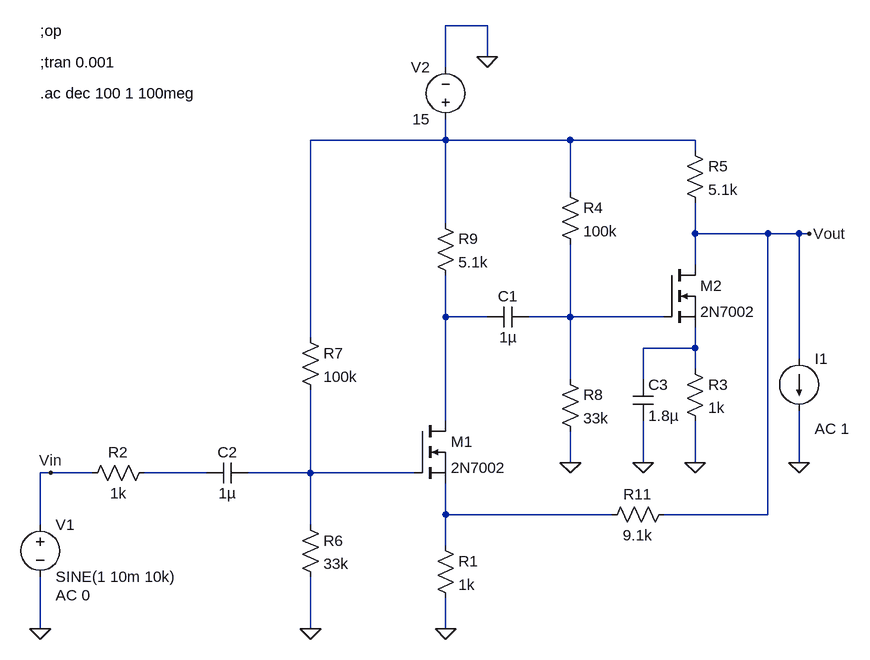
[diagram p0: schematic Nhóm05-L02-BTL MDTNC (Series-Shunt_feedback - Copy).asc]
Nhóm05-L02-BTL MDTNC (Series-Shunt_feedback - Copy).asc, the LTspice schematic file:
Version 4
SHEET 1 952 680
WIRE 336 -480 272 -480
WIRE 336 -432 336 -480
WIRE 272 -416 272 -480
WIRE 272 -304 272 -336
WIRE 272 -304 64 -304
WIRE 464 -304 272 -304
WIRE 656 -304 464 -304
WIRE 656 -288 656 -304
WIRE 464 -224 464 -304
WIRE 272 -176 272 -304
WIRE 656 -160 656 -208
WIRE 768 -160 656 -160
WIRE 816 -160 768 -160
WIRE 832 -160 816 -160
WIRE 656 -112 656 -160
WIRE 272 -32 272 -96
WIRE 336 -32 272 -32
WIRE 464 -32 464 -144
WIRE 464 -32 400 -32
WIRE 608 -32 464 -32
WIRE 64 0 64 -304
WIRE 656 16 656 -16
WIRE 656 16 576 16
WIRE 816 32 816 -160
WIRE 656 48 656 16
WIRE 464 64 464 -32
WIRE 576 64 576 16
WIRE 272 128 272 -32
WIRE 464 192 464 144
WIRE 576 192 576 128
WIRE 656 192 656 128
WIRE 816 192 816 112
WIRE -336 208 -352 208
WIRE -272 208 -336 208
WIRE -96 208 -192 208
WIRE 64 208 64 80
WIRE 64 208 -32 208
WIRE 224 208 64 208
WIRE 272 272 272 224
WIRE 528 272 272 272
WIRE 768 272 768 -160
WIRE 768 272 608 272
WIRE -352 288 -352 208
WIRE 64 288 64 208
WIRE 272 320 272 272
WIRE -352 448 -352 368
WIRE 64 448 64 368
WIRE 272 448 272 400
FLAG -352 448 0
FLAG -336 208 Vin
FLAG 272 448 0
FLAG 336 -432 0
FLAG 832 -160 Vout
FLAG 64 448 0
FLAG 464 192 0
FLAG 576 192 0
FLAG 656 192 0
FLAG 816 192 0
SYMBOL nmos 224 128 R0
SYMATTR InstName M1
SYMATTR Value 2N7002
SYMBOL nmos 608 -112 R0
SYMATTR InstName M2
SYMATTR Value 2N7002
SYMBOL res -176 192 R90
WINDOW 0 0 56 VBottom 2
WINDOW 3 32 56 VTop 2
SYMATTR InstName R2
SYMATTR Value 1k
SYMBOL voltage -352 272 R0
WINDOW 123 24 124 Left 2
WINDOW 39 0 0 Left 0
SYMATTR Value2 AC 0
SYMATTR InstName V1
SYMATTR Value SINE(1 10m 10k)
SYMBOL res 256 304 R0
SYMATTR InstName R1
SYMATTR Value 1k
SYMBOL res 640 -304 R0
SYMATTR InstName R5
SYMATTR Value 5.1k
SYMBOL res 640 32 R0
SYMATTR InstName R3
SYMATTR Value 1k
SYMBOL res 48 272 R0
SYMATTR InstName R6
SYMATTR Value 33k
SYMBOL res 48 -16 R0
SYMATTR InstName R7
SYMATTR Value 100k
SYMBOL cap -32 192 R90
WINDOW 0 0 32 VBottom 2
WINDOW 3 32 32 VTop 2
SYMATTR InstName C2
SYMATTR Value 1µ
SYMBOL res 448 -240 R0
SYMATTR InstName R4
SYMATTR Value 100k
SYMBOL res 448 48 R0
SYMATTR InstName R8
SYMATTR Value 33k
SYMBOL res 256 -192 R0
SYMATTR InstName R9
SYMATTR Value 5.1k
SYMBOL cap 400 -48 R90
WINDOW 0 0 32 VBottom 2
WINDOW 3 32 32 VTop 2
SYMATTR InstName C1
SYMATTR Value 1µ
SYMBOL res 624 256 R90
WINDOW 0 0 56 VBottom 2
WINDOW 3 32 56 VTop 2
SYMATTR InstName R11
SYMATTR Value 9.1k
SYMBOL cap 560 64 R0
SYMATTR InstName C3
SYMATTR Value 1.8µ
SYMBOL voltage 272 -320 R180
WINDOW 0 24 96 Left 2
WINDOW 3 24 16 Left 2
WINDOW 123 0 0 Left 0
WINDOW 39 0 0 Left 0
SYMATTR InstName V2
SYMATTR Value 15
SYMBOL current 816 32 R0
WINDOW 123 24 108 Left 2
WINDOW 39 0 0 Left 0
SYMATTR Value2 AC 1
SYMATTR InstName I1
SYMATTR Value ""
TEXT -352 -472 Left 2 !;op
TEXT -352 -424 Left 2 !;tran 0.001
TEXT -352 -376 Left 2 !.ac dec 100 1 100meg

The netlist it stands for:
* Nhóm05-L02-BTL MDTNC (Series-Shunt_feedback - Copy).asc
M1 N002 N006 N007 N007 2N7002
M2 Vout N003 N004 N004 2N7002
R2 N005 Vin 1k
V1 Vin 0 SINE(1 10m 10k) AC 0
R1 N007 0 1k
R5 N001 Vout 5.1k
R3 N004 0 1k
R6 N006 0 33k
R7 N001 N006 100k
C2 N006 N005 1µ
R4 N001 N003 100k
R8 N003 0 33k
R9 N001 N002 5.1k
C1 N003 N002 1µ
R11 Vout N007 9.1k
C3 N004 0 1.8µ
V2 N001 0 15
I1 Vout 0 AC 1
.model NMOS NMOS
.model PMOS PMOS
.lib standard.mos
;op
;tran 0.001
.ac dec 100 1 100meg
.backanno
.end